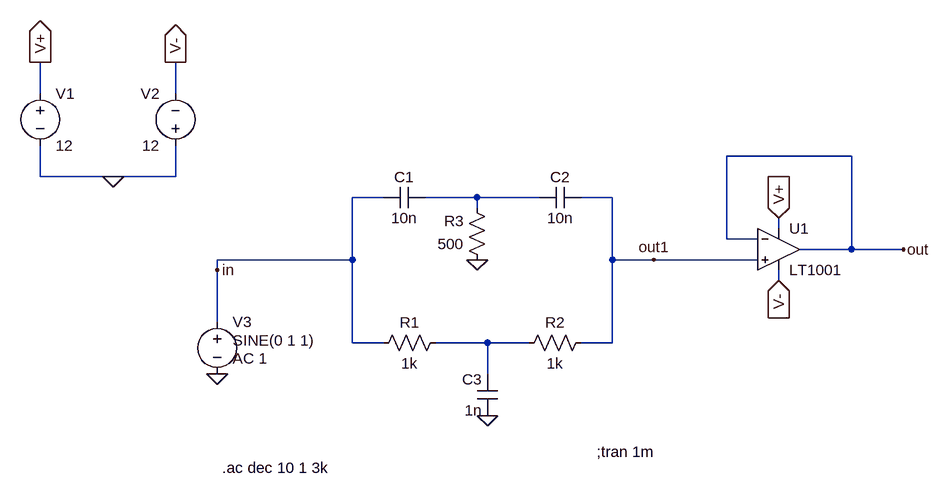
[diagram p0: schematic TP2.asc]
TP2.asc, the LTspice schematic file:
Version 4
SHEET 1 1036 680
WIRE -688 -240 -688 -288
WIRE -480 -240 -480 -288
WIRE 560 -144 368 -144
WIRE -688 -112 -688 -160
WIRE -576 -112 -688 -112
WIRE -480 -112 -480 -160
WIRE -480 -112 -576 -112
WIRE -160 -80 -208 -80
WIRE -16 -80 -96 -80
WIRE 80 -80 -16 -80
WIRE 192 -80 144 -80
WIRE -16 -64 -16 -80
WIRE 448 -32 448 -48
WIRE 368 -16 368 -144
WIRE 416 -16 368 -16
WIRE 560 0 560 -144
WIRE 560 0 480 0
WIRE 640 0 560 0
WIRE -208 16 -208 -80
WIRE -208 16 -416 16
WIRE 192 16 192 -80
WIRE 256 16 192 16
WIRE 416 16 256 16
WIRE -416 32 -416 16
WIRE 448 48 448 32
WIRE -416 112 -416 32
WIRE -208 144 -208 16
WIRE -160 144 -208 144
WIRE 0 144 -80 144
WIRE 64 144 0 144
WIRE 192 144 192 16
WIRE 192 144 144 144
WIRE 0 192 0 144
FLAG -576 -112 0
FLAG -688 -288 V+
IOPIN -688 -288 Out
FLAG -480 -288 V-
IOPIN -480 -288 Out
FLAG 448 -48 V+
IOPIN 448 -48 In
FLAG 448 48 V-
IOPIN 448 48 In
FLAG -16 16 0
FLAG 0 256 0
FLAG -416 192 0
FLAG 640 0 out
FLAG -416 32 in
FLAG 256 16 out1
SYMBOL voltage -688 -256 R0
WINDOW 123 0 0 Left 0
WINDOW 39 0 0 Left 0
SYMATTR InstName V1
SYMATTR Value 12
SYMBOL voltage -480 -144 R180
WINDOW 0 24 96 Left 2
WINDOW 3 24 16 Left 2
WINDOW 123 0 0 Left 0
WINDOW 39 0 0 Left 0
SYMATTR InstName V2
SYMATTR Value 12
SYMBOL res -64 128 R90
WINDOW 0 0 56 VBottom 2
WINDOW 3 32 56 VTop 2
SYMATTR InstName R1
SYMATTR Value 1k
SYMBOL res 160 128 R90
WINDOW 0 0 56 VBottom 2
WINDOW 3 32 56 VTop 2
SYMATTR InstName R2
SYMATTR Value 1k
SYMBOL res 0 32 R180
WINDOW 0 36 76 Left 2
WINDOW 3 36 40 Left 2
SYMATTR InstName R3
SYMATTR Value 500
SYMBOL cap -96 -96 R90
WINDOW 0 0 32 VBottom 2
WINDOW 3 32 32 VTop 2
SYMATTR InstName C1
SYMATTR Value 10n
SYMBOL cap 144 -96 R90
WINDOW 0 0 32 VBottom 2
WINDOW 3 32 32 VTop 2
SYMATTR InstName C2
SYMATTR Value 10n
SYMBOL cap 16 256 R180
WINDOW 0 24 56 Left 2
WINDOW 3 24 8 Left 2
SYMATTR InstName C3
SYMATTR Value 1n
SYMBOL voltage -416 96 R0
WINDOW 3 24 44 Left 2
WINDOW 123 24 72 Left 2
WINDOW 39 0 0 Left 0
SYMATTR Value SINE(0 1 1)
SYMATTR Value2 AC 1
SYMATTR InstName V3
SYMBOL OpAmps\\LT1001 448 -64 R0
SYMATTR InstName U1
TEXT -408 336 Left 2 !.ac dec 10 1 3k
TEXT 168 312 Left 2 !;tran 1m

The netlist it stands for:
* TP2.asc
V1 V+ 0 12
V2 0 V- 12
R1 N002 in 1k
R2 out1 N002 1k
R3 0 N001 500
C1 N001 in 10n
C2 out1 N001 10n
C3 0 N002 1n
V3 in 0 SINE(0 1 1) AC 1
XU1 out1 out V+ V- out LT1001  ; pins In+ In- V+ V- OUT
.ac dec 10 1 3k
;tran 1m
.lib LTC.lib
.backanno
.end